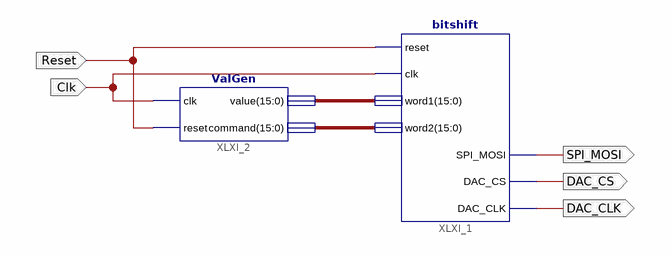
[diagram p0: schematic sheet 1]
// Xilinx ISE schematic Schem.sch (spartan3e) as structural Verilog: 2 symbols, 5 ports
module Schem (
  input  Clk,
  input  Reset,
  output SPI_MOSI,
  output DAC_CS,
  output DAC_CLK
);

  wire [15:0] XLXN_16, XLXN_17;

  bitshift XLXI_1 (
    .reset(Reset), .clk(Clk), .word1(XLXN_16), .word2(XLXN_17), .SPI_MOSI(SPI_MOSI), .DAC_CS(DAC_CS),
    .DAC_CLK(DAC_CLK));
  ValGen XLXI_2 (.clk(Clk), .reset(Reset), .value(XLXN_16), .command(XLXN_17));
endmodule
